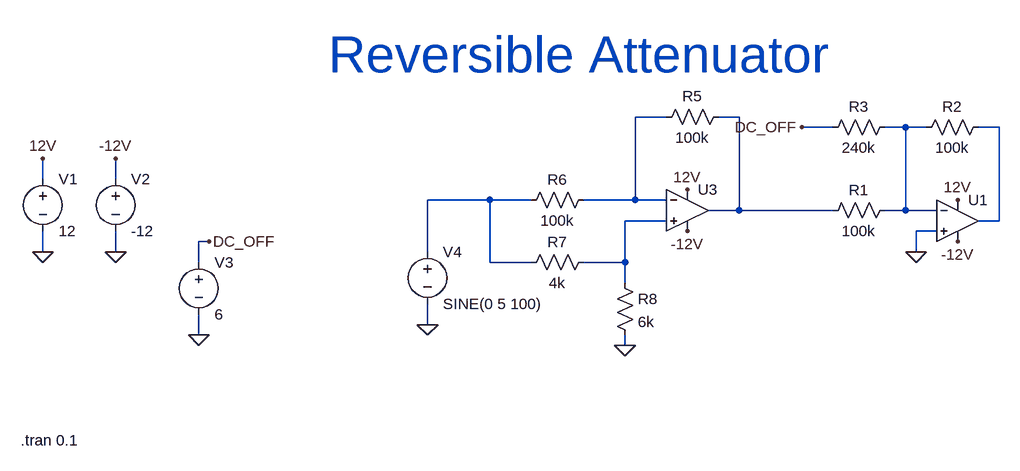
[diagram p0: schematic utility.asc]
utility.asc, the LTspice schematic file:
Version 4
SHEET 1 1252 680
WIRE 560 160 512 160
WIRE 672 160 640 160
WIRE 816 176 768 176
WIRE 928 176 896 176
WIRE 960 176 928 176
WIRE 1072 176 1040 176
WIRE -400 256 -400 224
WIRE -288 256 -288 224
WIRE 288 288 192 288
WIRE 352 288 288 288
WIRE 512 288 512 160
WIRE 512 288 432 288
WIRE 560 288 512 288
WIRE 672 304 672 160
WIRE 672 304 624 304
WIRE 816 304 672 304
WIRE 928 304 928 176
WIRE 928 304 896 304
WIRE 976 304 928 304
WIRE 560 320 496 320
WIRE 1072 320 1072 176
WIRE 1072 320 1040 320
WIRE 976 336 944 336
WIRE -144 352 -160 352
WIRE -400 368 -400 336
WIRE -288 368 -288 336
WIRE 192 368 192 288
WIRE 944 368 944 336
WIRE -160 384 -160 352
WIRE 288 384 288 288
WIRE 352 384 288 384
WIRE 496 384 496 320
WIRE 496 384 432 384
WIRE 496 416 496 384
WIRE 192 480 192 448
WIRE -160 496 -160 464
WIRE 496 512 496 496
FLAG -400 368 0
FLAG -400 224 12V
FLAG -288 368 0
FLAG -288 224 -12V
FLAG 592 272 12V
FLAG 592 336 -12V
FLAG 496 512 0
FLAG 192 480 0
FLAG 1008 288 12V
FLAG 1008 352 -12V
FLAG 944 368 0
FLAG -160 496 0
FLAG -144 352 DC_OFF
FLAG 768 176 DC_OFF
SYMBOL voltage -400 240 R0
WINDOW 123 0 0 Left 0
WINDOW 39 0 0 Left 0
SYMATTR InstName V1
SYMATTR Value 12
SYMBOL voltage -288 240 R0
WINDOW 123 0 0 Left 0
WINDOW 39 0 0 Left 0
SYMATTR InstName V2
SYMATTR Value -12
SYMBOL res 656 144 R90
WINDOW 0 0 56 VBottom 2
WINDOW 3 32 56 VTop 2
SYMATTR InstName R5
SYMATTR Value 100k
SYMBOL res 448 272 R90
WINDOW 0 0 56 VBottom 2
WINDOW 3 32 56 VTop 2
SYMATTR InstName R6
SYMATTR Value 100k
SYMBOL Opamps\\UniversalOpamp2 592 304 R0
SYMATTR InstName U3
SYMBOL res 448 368 R90
WINDOW 0 0 56 VBottom 2
WINDOW 3 32 56 VTop 2
SYMATTR InstName R7
SYMATTR Value 4k
SYMBOL res 480 400 R0
SYMATTR InstName R8
SYMATTR Value 6k
SYMBOL voltage 192 352 R0
WINDOW 123 0 0 Left 0
WINDOW 39 0 0 Left 0
SYMATTR InstName V4
SYMATTR Value SINE(0 5 100)
SYMBOL Opamps\\UniversalOpamp2 1008 320 R0
SYMATTR InstName U1
SYMBOL res 912 288 R90
WINDOW 0 0 56 VBottom 2
WINDOW 3 32 56 VTop 2
SYMATTR InstName R1
SYMATTR Value 100k
SYMBOL res 1056 160 R90
WINDOW 0 0 56 VBottom 2
WINDOW 3 32 56 VTop 2
SYMATTR InstName R2
SYMATTR Value 100k
SYMBOL res 912 160 R90
WINDOW 0 0 56 VBottom 2
WINDOW 3 32 56 VTop 2
SYMATTR InstName R3
SYMATTR Value 240k
SYMBOL voltage -160 368 R0
WINDOW 123 0 0 Left 0
WINDOW 39 0 0 Left 0
SYMATTR InstName V3
SYMATTR Value 6
TEXT -434 658 Left 2 !.tran 0.1
TEXT 40 64 Left 6 ;Reversible Attenuator

The netlist it stands for:
* utility.asc
V1 12V 0 12
V2 -12V 0 -12
R5 N002 N001 100k
R6 N001 N005 100k
XU3 N006 N001 12V -12V N002 level.2 Avol=1Meg GBW=10Meg Slew=10Meg ilimit=25m rail=0 Vos=0 phimargin=45 en=0 enk=0 in=0 ink=0 Rin=500Meg  ; pins IN+ IN- V+ V- OUT
R7 N006 N005 4k
R8 N006 0 6k
V4 N005 0 SINE(0 5 100)
XU1 0 N003 12V -12V N004 level.2 Avol=1Meg GBW=10Meg Slew=10Meg ilimit=25m rail=0 Vos=0 phimargin=45 en=0 enk=0 in=0 ink=0 Rin=500Meg  ; pins IN+ IN- V+ V- OUT
R1 N003 N002 100k
R2 N004 N003 100k
R3 N003 DC_OFF 240k
V3 DC_OFF 0 6
.tran 0.1
* Reversible Attenuator
.lib UniversalOpamps2.sub
.backanno
.end